# Altium schematic sheet top.schdoc: TOP
size A4; Date: 10.25.2025; CheckedBy: BCY; DrawnBy: miaow; DocumentNumber: 1; Revision: v1.0.0; SheetNumber: 1; SheetTotal: 14; BoardType: MAIN_PCB; Desc: Top block diagram
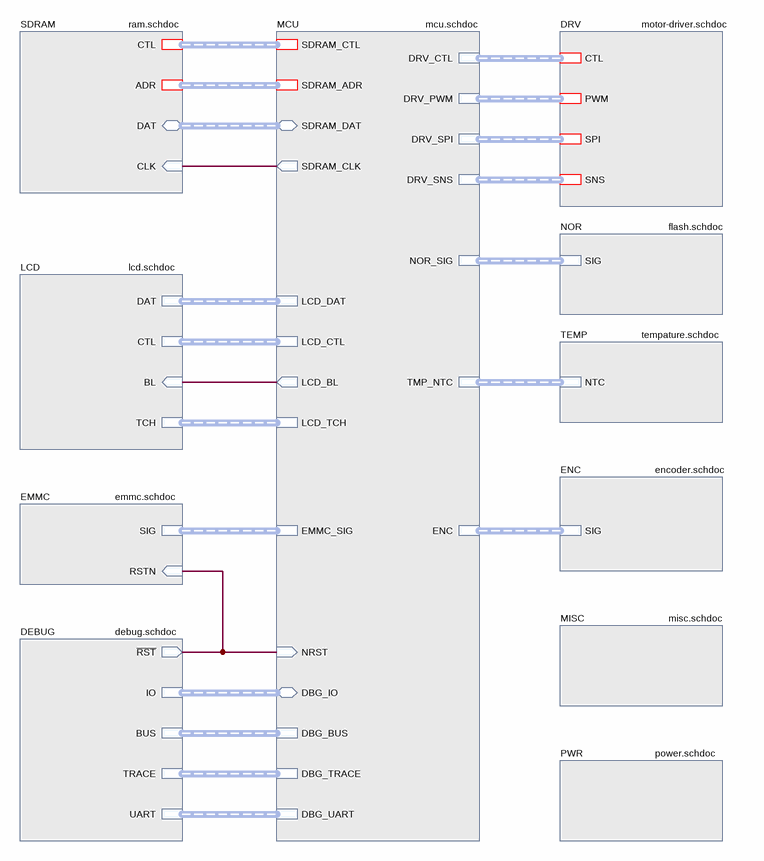
[diagram p0: top.schdoc]

## Sub-sheets
DEBUG = debug.schdoc: BUS (harness DBG_BUS), ~{RST} (out), TRACE (harness DBG_TRACE), UART (harness DBG_UART), IO (harness DBG_IO)
DRV = motor-driver.schdoc: CTL (harness DRV_CTL), SNS (harness DRV_SNS), SPI (harness DRV_SPI), PWM (harness DRV_PWM)
EMMC = emmc.schdoc: SIG (harness EMMC_SIG), RSTN (in)
ENC = encoder.schdoc: SIG (harness ENC_SIG)
LCD = lcd.schdoc: DAT (harness LCD_DAT), CTL (harness LCD_CTL), BL (in), TCH (harness LCD_TCH)
MCU = mcu.schdoc: SDRAM_CLK (out), SDRAM_CTL (harness SDRAM_CTL), SDRAM_ADR (harness SDRAM_ADR), SDRAM_DAT (bidir, harness SDRAM_DAT), DRV_CTL (harness DRV_CTL), DRV_PWM (harness DRV_PWM), DRV_SPI (harness DRV_SPI), DRV_SNS (harness DRV_SNS), NRST (in), LCD_DAT (harness LCD_DAT), LCD_BL (out), LCD_TCH (harness LCD_TCH), EMMC_SIG (harness EMMC_SIG), NOR_SIG (harness NOR_SIG), LCD_CTL (harness LCD_CTL), DBG_TRACE (harness DBG_TRACE), DBG_UART (harness DBG_UART), DBG_BUS (harness DBG_BUS), DBG_IO (bidir, harness DBG_IO), TMP_NTC (harness TMP_NTC), ENC (harness ENC_SIG)
MISC = misc.schdoc: no entries
NOR = flash.schdoc: SIG (harness NOR_SIG)
PWR = power.schdoc: no entries
SDRAM = ram.schdoc: ADR (harness SDRAM_ADR), CTL (harness SDRAM_CTL), CLK (in), DAT (bidir, harness SDRAM_DAT)
TEMP = tempature.schdoc: NTC (harness TMP_NTC)

## Nets
(unnamed): sheet SDRAM/CLK, sheet MCU/SDRAM_CLK
(unnamed): sheet MCU/NRST, sheet EMMC/RSTN, sheet DEBUG/~{RST}
(unnamed): sheet MCU/LCD_BL, sheet LCD/BL

## Buses and harness runs
harness sheet DEBUG/BUS = sheet MCU/DBG_BUS
harness sheet DEBUG/IO = sheet MCU/DBG_IO
harness sheet DEBUG/TRACE = sheet MCU/DBG_TRACE
harness sheet DEBUG/UART = sheet MCU/DBG_UART
harness sheet DRV/CTL = sheet MCU/DRV_CTL
harness sheet DRV/PWM = sheet MCU/DRV_PWM
harness sheet DRV/SNS = sheet MCU/DRV_SNS
harness sheet DRV/SPI = sheet MCU/DRV_SPI
harness sheet EMMC/SIG = sheet MCU/EMMC_SIG
harness sheet ENC/SIG = sheet MCU/ENC
harness sheet LCD/CTL = sheet MCU/LCD_CTL
harness sheet LCD/DAT = sheet MCU/LCD_DAT
harness sheet LCD/TCH = sheet MCU/LCD_TCH
harness sheet MCU/NOR_SIG = sheet NOR/SIG
harness sheet MCU/SDRAM_ADR = sheet SDRAM/ADR
harness sheet MCU/SDRAM_CTL = sheet SDRAM/CTL
harness sheet MCU/SDRAM_DAT = sheet SDRAM/DAT
harness sheet MCU/TMP_NTC = sheet TEMP/NTC

## Notes on the sheet
- DRAWN
- CHECKED
- DRAWNBY
- SHEETS
- SHEETS_NO